# Altium schematic sheet 8266WROOM.SchDoc
size A3
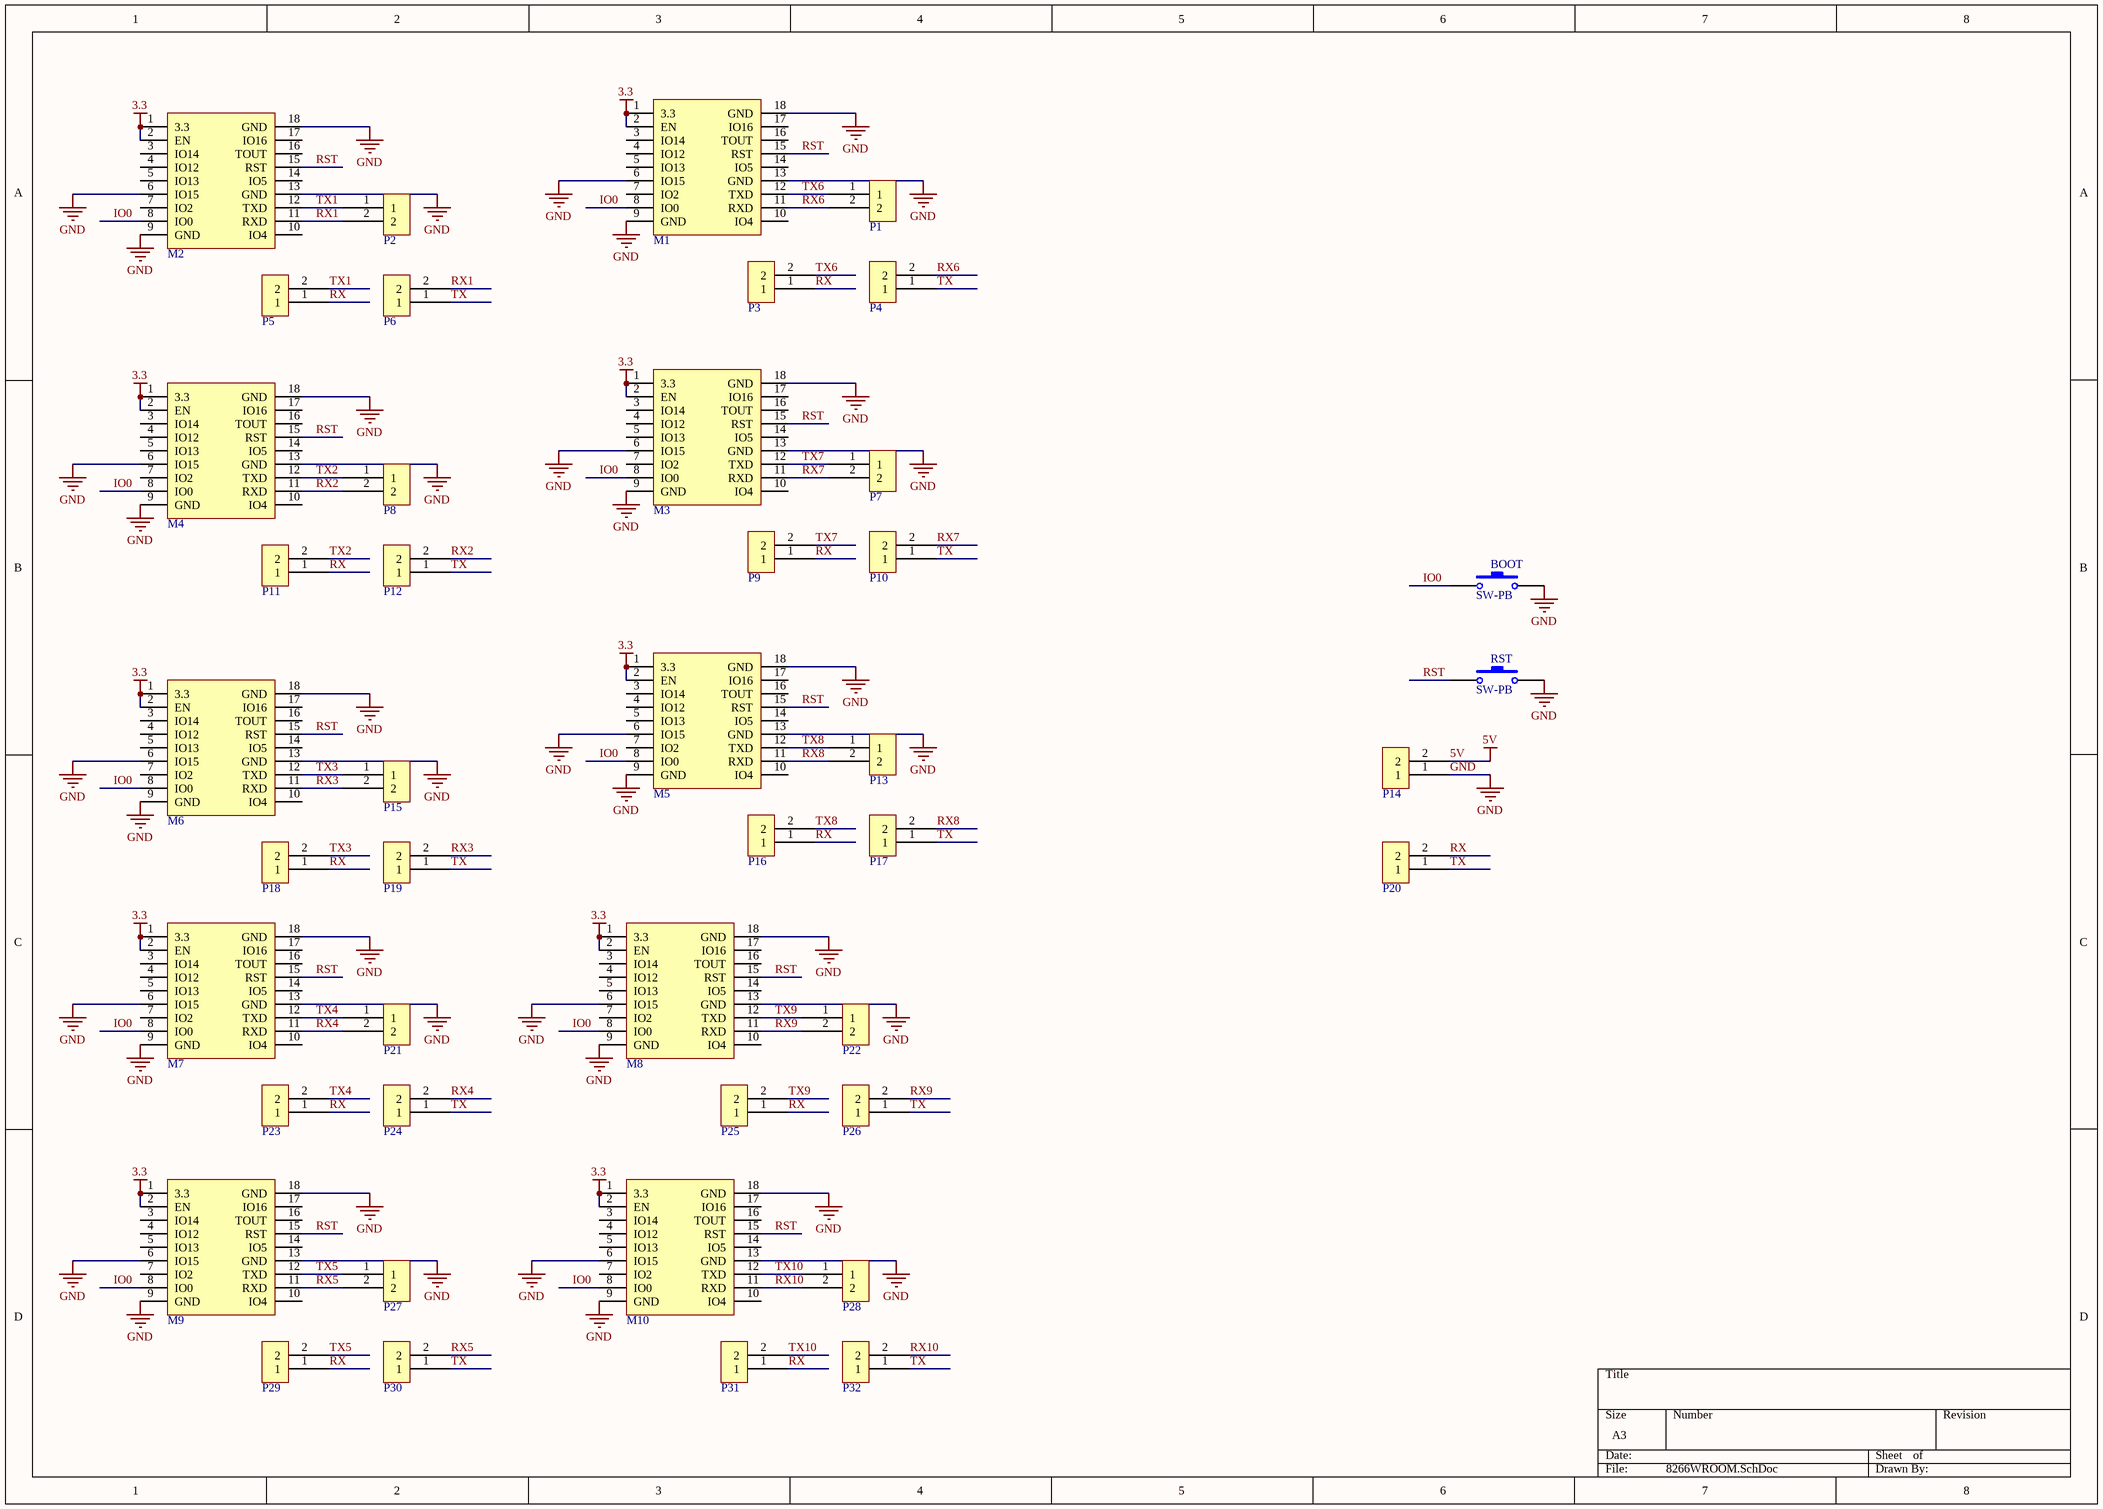
[diagram p0: 8266WROOM.SchDoc]

## Parts
BOOT  SW-PB  [SW3x4]
M1  ESP8266_WROOM02  [ESP8266-WROOM-02]  (value not drawn)
M2  ESP8266_WROOM02  [ESP8266-WROOM-02]  (value not drawn)
M3  ESP8266_WROOM02  [ESP8266-WROOM-02]  (value not drawn)
M4  ESP8266_WROOM02  [ESP8266-WROOM-02]  (value not drawn)
M5  ESP8266_WROOM02  [ESP8266-WROOM-02]  (value not drawn)
M6  ESP8266_WROOM02  [ESP8266-WROOM-02]  (value not drawn)
M7  ESP8266_WROOM02  [ESP8266-WROOM-02]  (value not drawn)
M8  ESP8266_WROOM02  [ESP8266-WROOM-02]  (value not drawn)
M9  ESP8266_WROOM02  [ESP8266-WROOM-02]  (value not drawn)
M10  ESP8266_WROOM02  [ESP8266-WROOM-02]  (value not drawn)
P1  2P  [2P]  (value not drawn)
P2  2P  [2P]  (value not drawn)
P3  2P  [2P]  (value not drawn)
P4  2P  [2P]  (value not drawn)
P5  2P  [2P]  (value not drawn)
P6  2P  [2P]  (value not drawn)
P7  2P  [2P]  (value not drawn)
P8  2P  [2P]  (value not drawn)
P9  2P  [2P]  (value not drawn)
P10  2P  [2P]  (value not drawn)
P11  2P  [2P]  (value not drawn)
P12  2P  [2P]  (value not drawn)
P13  2P  [2P]  (value not drawn)
P14  2P  [2P]  (value not drawn)
P15  2P  [2P]  (value not drawn)
P16  2P  [2P]  (value not drawn)
P17  2P  [2P]  (value not drawn)
P18  2P  [2P]  (value not drawn)
P19  2P  [2P]  (value not drawn)
P20  2P  [2P]  (value not drawn)
P21  2P  [2P]  (value not drawn)
P22  2P  [2P]  (value not drawn)
P23  2P  [2P]  (value not drawn)
P24  2P  [2P]  (value not drawn)
P25  2P  [2P]  (value not drawn)
P26  2P  [2P]  (value not drawn)
P27  2P  [2P]  (value not drawn)
P28  2P  [2P]  (value not drawn)
P29  2P  [2P]  (value not drawn)
P30  2P  [2P]  (value not drawn)
P31  2P  [2P]  (value not drawn)
P32  2P  [2P]  (value not drawn)
RST  SW-PB  [SW3x4]

## Nets
3.3: M1.1(3.3) M1.2(EN) M2.1(3.3) M2.2(EN) M3.1(3.3) M3.2(EN) M4.1(3.3) M4.2(EN) M5.1(3.3) M5.2(EN) M6.1(3.3) M6.2(EN) M7.1(3.3) M7.2(EN) M8.1(3.3) M8.2(EN) M9.1(3.3) M9.2(EN) M10.1(3.3) M10.2(EN)
5V: P14.2
GND: BOOT.2 M1.6(IO15) M1.9(GND) M1.13(GND) M1.18(GND) M2.6(IO15) M2.9(GND) M2.13(GND) M2.18(GND) M3.6(IO15) M3.9(GND) M3.13(GND) M3.18(GND) M4.6(IO15) M4.9(GND) M4.13(GND) M4.18(GND) M5.6(IO15) M5.9(GND) M5.13(GND) M5.18(GND) M6.6(IO15) M6.9(GND) M6.13(GND) M6.18(GND) M7.6(IO15) M7.9(GND) M7.13(GND) M7.18(GND) M8.6(IO15) M8.9(GND) M8.13(GND) M8.18(GND) M9.6(IO15) M9.9(GND) M9.13(GND) M9.18(GND) M10.6(IO15) M10.9(GND) M10.13(GND) M10.18(GND) P14.1 RST.2
IO0: BOOT.1 M1.8(IO0) M2.8(IO0) M3.8(IO0) M4.8(IO0) M5.8(IO0) M6.8(IO0) M7.8(IO0) M8.8(IO0) M9.8(IO0) M10.8(IO0)
RST: M1.15(RST) M2.15(RST) M3.15(RST) M4.15(RST) M5.15(RST) M6.15(RST) M7.15(RST) M8.15(RST) M9.15(RST) M10.15(RST) RST.1
RX: P3.1 P5.1 P9.1 P11.1 P16.1 P18.1 P20.2 P23.1 P25.1 P29.1 P31.1
RX1: M2.11(RXD) P2.2 P6.2
RX2: M4.11(RXD) P8.2 P12.2
RX3: M6.11(RXD) P15.2 P19.2
RX4: M7.11(RXD) P21.2 P24.2
RX5: M9.11(RXD) P27.2 P30.2
RX6: M1.11(RXD) P1.2 P4.2
RX7: M3.11(RXD) P7.2 P10.2
RX8: M5.11(RXD) P13.2 P17.2
RX9: M8.11(RXD) P22.2 P26.2
RX10: M10.11(RXD) P28.2 P32.2
TX: P4.1 P6.1 P10.1 P12.1 P17.1 P19.1 P20.1 P24.1 P26.1 P30.1 P32.1
TX1: M2.12(TXD) P2.1 P5.2
TX2: M4.12(TXD) P8.1 P11.2
TX3: M6.12(TXD) P15.1 P18.2
TX4: M7.12(TXD) P21.1 P23.2
TX5: M9.12(TXD) P27.1 P29.2
TX6: M1.12(TXD) P1.1 P3.2
TX7: M3.12(TXD) P7.1 P9.2
TX8: M5.12(TXD) P13.1 P16.2
TX9: M8.12(TXD) P22.1 P25.2
TX10: M10.12(TXD) P28.1 P31.2

Not connected (* = marked no-connect by the designer): M1 3(IO14) 4(IO12) 5(IO13) 7(IO2) 10(IO4) 14(IO5) 16(TOUT) 17(IO16); M2 3(IO14) 4(IO12) 5(IO13) 7(IO2) 10(IO4) 14(IO5) 16(TOUT) 17(IO16); M3 3(IO14) 4(IO12) 5(IO13) 7(IO2) 10(IO4) 14(IO5) 16(TOUT) 17(IO16); M4 3(IO14) 4(IO12) 5(IO13) 7(IO2) 10(IO4) 14(IO5) 16(TOUT) 17(IO16); M5 3(IO14) 4(IO12) 5(IO13) 7(IO2) 10(IO4) 14(IO5) 16(TOUT) 17(IO16); M6 3(IO14) 4(IO12) 5(IO13) 7(IO2) 10(IO4) 14(IO5) 16(TOUT) 17(IO16); M7 3(IO14) 4(IO12) 5(IO13) 7(IO2) 10(IO4) 14(IO5) 16(TOUT) 17(IO16); M8 3(IO14) 4(IO12) 5(IO13) 7(IO2) 10(IO4) 14(IO5) 16(TOUT) 17(IO16); M9 3(IO14) 4(IO12) 5(IO13) 7(IO2) 10(IO4) 14(IO5) 16(TOUT) 17(IO16); M10 3(IO14) 4(IO12) 5(IO13) 7(IO2) 10(IO4) 14(IO5) 16(TOUT) 17(IO16)

## Library data of the parts
BOOT RST = SW-PB: Switch; Published: 24-Mar-1999; LatestRevisionDate: 17-Jul-2002; LatestRevisionNote: Re-released for DXP Platform.; PackageReference: SPST-2; Publisher: Altium Limited; PackageDescription: Switch; 2 Leads